# EAGLE schematic Serial_LCD (EAGLE 6.5.0)
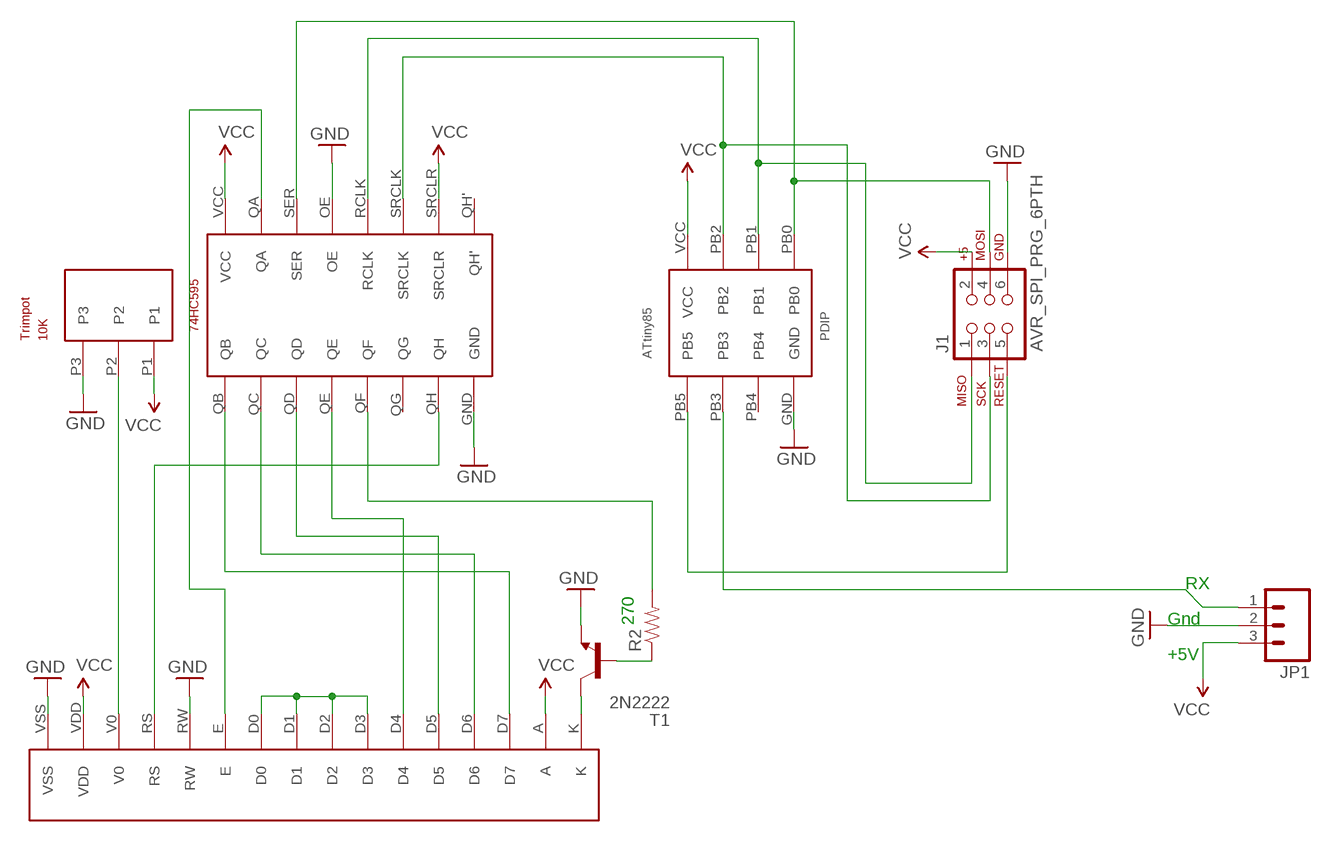
[diagram p0: schematic, sheet 1]

## Parts
J1  AVR_SPI_PRG_6PTH  [2X3]
JP1  M03PTH  [1X03]
R1  TRIMPOT-3386P  [TRIMPOT-3386P]
R2  RESISTORPTH-1/4W  [AXIAL-0.4]
T1  2N2222  [TO92-EBC-OVAL]
U1  SN74HC595N  [SN74HC595N]
U2  ATTINY85-20PU  [ATTINY85-20PU]
U$1  16X2_LCD  [16X2_LCD]

## Nets
GND: J1.6 JP1.2 R1.P3 T1.E U1.GND U1.OE U2.GND U$1.RW U$1.VSS
N$1: R1.P2 U$1.V0
N$2: R2.P$1 T1.B
N$3: T1.C U$1.K
N$4: J1.4 U1.SER U2.PB0
N$5: U1.QB U$1.D7
N$6: U1.QC U$1.D6
N$7: U1.QD U$1.D5
N$8: U1.QE U$1.D4
N$9: R2.P$2 U1.QF
N$10: U$1.D0 U$1.D1 U$1.D2 U$1.D3
N$11: U1.QH U$1.RS
N$12: U1.QA U$1.E
N$13: J1.1 U1.RCLK U2.PB1
N$14: J1.3 U1.SRCLK U2.PB2
N$15: J1.5 U2.PB5
N$18: JP1.1 U2.PB3
VCC: J1.2 JP1.3 R1.P1 U1.SRCLR U1.VCC U2.VCC U$1.A U$1.VDD
Unconnected: U1.QG U1.QH' U2.PB4

## Notes on the sheet
- RX
- 270 | Gnd
- +5V

## Library data of the parts
J1 = SparkFun-Connectors:AVR_SPI_PRG_6: AVR ISP 6 Pin This is the reduced ISP connector for AVR programming. Common on Arduino. This footprint will take up less PCB space and can be used with a 10-pin to 6-pin adapter such as SKU: BOB-08508
JP1 = SparkFun-Connectors:M03: Header 3 Standard 3-pin 0.1" header. Use with straight break away headers (SKU : PRT-00116), right angle break away headers (PRT-00553), swiss pins (PRT-00743), machine pins (PRT-00117), and female headers (PRT-00115). Molex polarized connector foot print use with SKU : PRT-08232 with associated crimp pins and housings.
R1 = Daniel:TRIMPOT-3386P
R2 = SparkFun-Passives:RESISTOR: Resistor Basic schematic elements and footprints for 0603, 1206, and PTH resistors.
T1 = adafruit:2N2222: NPN TRANSISTOR Big oval pads
U1 = Daniel:SN74HC595N
U2 = Daniel:ATTINY85-20PU: ATtiny-25/45/85 ￼￼Operating Voltage ￼￼•1.8 - 5.5V for ATtiny25V/45V/85V ￼￼•2.7 - 5.5V for ATtiny25/45/85 ATtiny25V/45V/85V ￼￼•0 – 4 MHz @ 1.8 - 5.5V •0 - 10 MHz @ 2.7 - 5.5V ATtiny25/45/85:0–10MHz@2.7-5.5V ￼￼•0-20MHz@4.5-5.5V Features- ￼￼•2/4/8K Bytes of In-System Programmable Program Memory Flash ￼￼•128/256/512 Bytes In-System Programmable EEPROM ￼￼•128/256/512 Bytes Internal SRAM
U$1 = Daniel:16X2_LCD: 16x2 Character LCD Display Uses the Hitachi HD44780 Controller